# EAGLE design CDC_Amp_v31 (EAGLE 8.4.1)
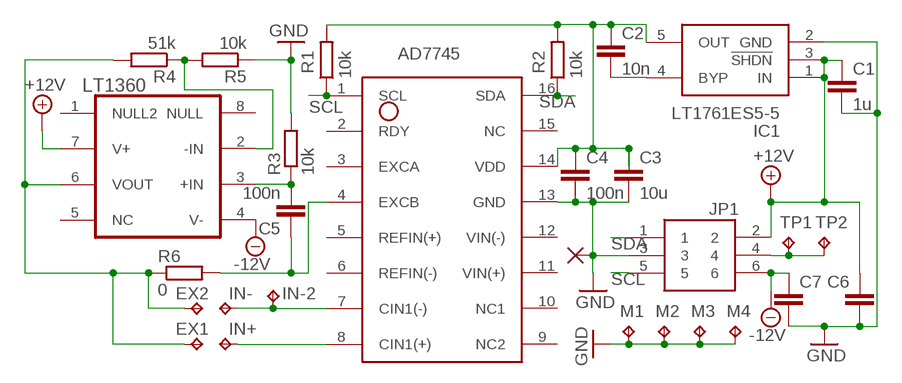
[diagram p0: schematic, sheet 1]

## Parts
AD7745  AD7745  AD7745_TSSOP_16  [AD7745_TSSOP_16]
C1  1u  RCL_C-EUC0805  [RCL_C0805]
C2  10n  RCL_C-EUC0805  [RCL_C0805]
C3  10u  RCL_C-EUC0805  [RCL_C0805]
C4  100n  RCL_C-EUC0805  [RCL_C0805]
C5  100n  RCL_C-EUC0805  [RCL_C0805]
C6  RCL_C-EUC1206  [RCL_C1206]
C7  RCL_C-EUC1206  [RCL_C1206]
EX1  TESTPAD_TPTP15R  [TESTPAD_TP15R]
EX2  TESTPAD_TPTP15R  [TESTPAD_TP15R]
GND  WIREPAD_1,6/0,8  [WIREPAD_1,6/0,8]
IC1  LT1761ES5-5  SAMACSYS_PARTS_LT1761ES5-5#TRMPBF  [SAMACSYS_PARTS_SOT95P280X100-5N]
IN+  TESTPAD_TPTP12R  [TESTPAD_TP12R]
IN-  TESTPAD_TPTP12R  [TESTPAD_TP12R]
IN-2  TESTPAD_TPTP12R  [TESTPAD_TP12R]
JP1  SAMACSYS_PARTS_FTSH-103-01-F-D  [SAMACSYS_PARTS_FTSH10301FD]
LT1360  LT1360CS8PBF  [SO8]
M1  TESTPAD_TPTP15R  [TESTPAD_TP15R]
M2  TESTPAD_TPTP15R  [TESTPAD_TP15R]
M3  TESTPAD_TPTP15R  [TESTPAD_TP15R]
M4  TESTPAD_TPTP15R  [TESTPAD_TP15R]
R1  10k  RCL_R-EU_R0805  [RCL_R0805]
R2  10k  RCL_R-EU_R0805  [RCL_R0805]
R3  10k  RCL_R-EU_R0805  [RCL_R0805]
R4  51k  RCL_R-EU_R0805  [RCL_R0805]
R5  10k  RCL_R-EU_R0805  [RCL_R0805]
R6  0  RCL_R-EU_R0603  [RCL_R0603]
TP1  TESTPAD_TPTP08SQ  [TESTPAD_TP08SQ]
TP2  TESTPAD_TPTP08SQ  [TESTPAD_TP08SQ]

## Nets
+12V: C1.1 C6.1 IC1.1(IN) IC1.3(!SHDN) JP1.2 LT1360.7(V+)
-12V: C7.1 JP1.6 LT1360.4(V-)
EX_IN: AD7745.4(EXCB) C5.1 R6.2
EX_OUT: EX1.TP EX2.TP LT1360.6(VOUT) R4.2 R6.1
GND: AD7745.13(GND) C1.2 C3.2 C4.2 C6.2 C7.2 GND.1(P) IC1.2(GND) JP1.3 M1.TP M2.TP M3.TP M4.TP R3.2 R5.1
N$1: C5.2 LT1360.3(+IN) R3.1
N$2: LT1360.2(-IN) R4.1 R5.2
N$6: JP1.4 TP1.TP TP2.TP
N$8: C2.2 IC1.4(BYP)
SCL: AD7745.1(SCL) JP1.5 R1.1
SDA: AD7745.16(SDA) JP1.1 R2.1
SIGIN: AD7745.8(CIN1(+)) IN+.TP
SIGIN-: AD7745.7(CIN1(-)) IN-2.TP IN-.TP
V_DD: AD7745.14(VDD) C2.1 C3.1 C4.1 IC1.5(OUT) R1.2 R2.2
Unconnected: AD7745.2(RDY) AD7745.3(EXCA) AD7745.5(REFIN(+)) AD7745.6(REFIN(-)) AD7745.9(NC2) AD7745.10(NC1) AD7745.11(VIN(+)) AD7745.12(VIN(-)) AD7745.15(NC) LT1360.1(NULL2) LT1360.5(NC) LT1360.8(NULL)

## Library data of the parts
AD7745 = CDC_Parts:AD7745_TSSOP_16: The AD7745/AD7746 are a high resolution, Σ-Δ capacitance-todigital converter (CDC). The capacitance to be measured is connected directly to the device inputs. The architecture features inherent high resolution (24-bit no missing codes, up to 21-bit effective resolution), high linearity (±0.01%), and high accuracy (±4 fF factory calibrated). The AD7745/AD7746 capacitance input range is ±4 pF (changing), while it can accept up to 17 pF common-mode capacitance (not changing), which can be balanced by a programmable on-chip, digital-tocapacitance converter (CAPDAC). The AD7745 has one capacitance input channel, while the AD7746 has two channels. Each channel can be configured as single-ended or differential. The AD7745/AD7746 are designed for floating capacitive sensors. For capacitive sensors with one plate connected to ground, the AD7747 is recommended. The parts have an on-chip temperature sensor with a resolution of 0.1°C and accuracy of ±2°C. The on-chip voltage reference and the on-chip clock generator eliminate the need for any external components in capacitive sensor applications. The parts have a standard voltage input, which together with the differential reference input allows easy interface to an external temperature sensor, such as an RTD, thermistor, or diode. The AD7745/AD7746 have a 2-wire, I2 C-compatible serial interface. Both parts can operate with a single power supply from 2.7 V to 5.25 V. They are specified over the automotive temperature range of –40°C to +125°C and are housed in a 16-lead TSSOP package.
C1-C7 = CDC_Parts:RCL_C-EU: CAPACITOR, European symbol; SPICEPREFIX: C
EX1 EX2 IN+ IN- IN-2 M1-M4 TP1 TP2 = CDC_Parts:TESTPAD_TP: Test pad
GND = CDC_Parts:WIREPAD_1,6/0,8: THROUGH-HOLE PAD
IC1 = CDC_Parts:SAMACSYS_PARTS_LT1761ES5-5#TRMPBF: Linear Technology LT1761ES5-3.3#TRMPBF, LDO Voltage Regulator, 100mA, 3.3 V, 1.8 20 Vin 5-Pin Source: Datasheet <https://componentsearchengine.com/Datasheets/1/LT1761ES5-3.3#TRMPBF.pdf>; DESCRIPTION: Linear Technology LT1761ES5-3.3#TRMPBF, LDO Voltage Regulator, 100mA, 3.3 V, 1.8 20 Vin 5-Pin; HEIGHT: 1mm; MANUFACTURER_NAME: Linear Technology; MANUFACTURER_PART_NUMBER: LT1761ES5-3.3#TRMPBF; MOUSER_PART_NUMBER: 584-1761ES5-3.3TMPF; MOUSER_PRICE-STOCK: https://www.mouser.com/Search/Refine.aspx?Keyword=584-1761ES5-3.3TMPF
JP1 = CDC_Parts:SAMACSYS_PARTS_FTSH-103-01-F-D: Conn Unshrouded Header HDR 6 POS 1.27mm Solder ST Thru-Hole Source: Datasheet <https://componentsearchengine.com/Datasheets/1/FTSH-103-01-F-D.pdf>; DESCRIPTION: Conn Unshrouded Header HDR 6 POS 1.27mm Solder ST Thru-Hole; HEIGHT: 5.56mm; MANUFACTURER_NAME: SAMTEC; MANUFACTURER_PART_NUMBER: FTSH-103-01-F-D; MOUSER_PART_NUMBER: 200-FTSH10301FD; MOUSER_PRICE-STOCK: https://www.mouser.com/Search/Refine.aspx?Keyword=200-FTSH10301FD
LT1360 = CDC_Parts:LT1360CS8PBF: 50MHz, 800V/us Op Amp; MPN: LT1360CS8#PBF; OC_FARNELL: 1330641; OC_NEWARK: 57M3487; PACKAGE: SOIC-8; SUPPLIER: Linear Technology
R1-R6 = CDC_Parts:RCL_R-EU_: RESISTOR, European symbol; SPICEPREFIX: R

## Board
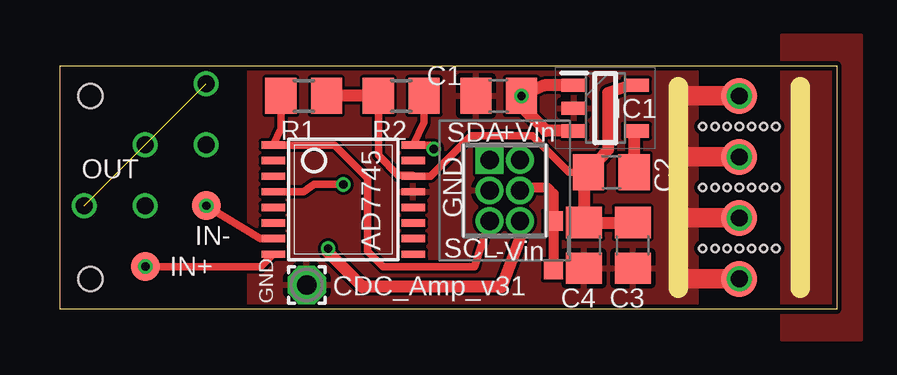
[diagram p1: board, top side]
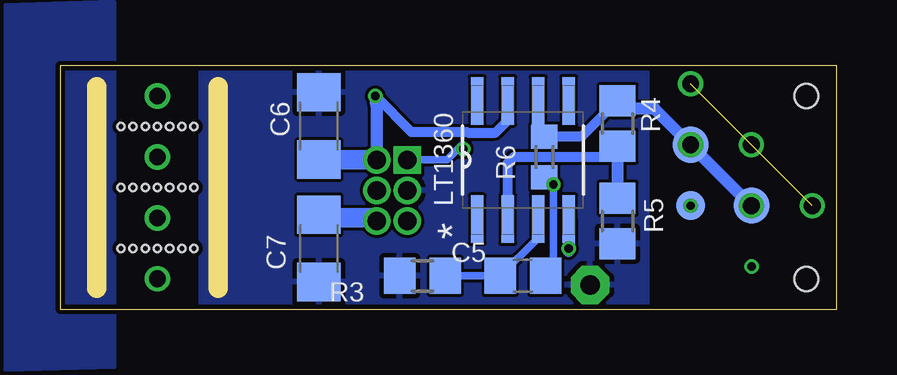
[diagram p2: board, bottom side, seen from below]

Size 32.38 x 10.16 mm. Coordinates in mm from the lower left corner, seen from the top.
Outline: 32.38,0 0,0 0,10.16 32.38,10.16 32.38,0
Copper layers (1*16): Top 0.018mm / dielectric 1.55mm / Bottom 0.018mm
Design rules "Multi-CB_2L_125um-Tracks_OL35um *": minimum track width 0.125mm, minimum drill 0.2mm, track to track 0.125mm, track to pad 0.125mm, pad to pad 0.1mm, via to via 0.125mm, smd to smd 0mil, copper to edge 0.2mm, drill to drill 0.2mm, minimum pad ring 0.125mm, minimum via ring 0.125mm, stop-mask expansion 2mil, vias tented up to drill 0.45mm, thermal gap 0.2mm
Holes 1 mm at 1.27,8.89 1.27,1.27
Holes 0.3 mm at 29.84,2.54 29.34,2.54 28.83,2.54 28.32,2.54 27.81,2.54 27.3,2.54 26.8,2.54 29.84,5.08 29.34,5.08 28.83,5.08 28.32,5.08 27.81,5.08 27.3,5.08 26.8,5.08 29.84,7.62 29.34,7.62 28.83,7.62 28.32,7.62 27.81,7.62 27.3,7.62 26.8,7.62
Milling: 2 lines

### Footprints (pad centres in the part's own frame; a part is rotated, then mirrored left to right if it is on the bottom)
AD7745_TSSOP_16 = smd 0.305 x 0.991: 1 -2.275,-2.918; 2 -1.625,-2.918; 3 -0.975,-2.918; 4 -0.325,-2.918; 5 0.325,-2.918; 6 0.975,-2.918; 7 1.625,-2.918; 8 2.275,-2.918; 9 2.275,2.918; 10 1.625,2.918; 11 0.975,2.918; 12 0.325,2.918; 13 -0.325,2.918; 14 -0.975,2.918; 15 -1.625,2.918; 16 -2.275,2.918
RCL_C0805 = smd 1.3 x 1.5: 1 -0.95,0; 2 0.95,0
RCL_C1206 = smd 1.6 x 1.8: 1 -1.4,0; 2 1.4,0
TESTPAD_TP15R = smd 1.5 x 1.5: TP 0,0
WIREPAD_1,6/0,8 = drill 0.813 pad 1.6 octagon: 1 0,0
SAMACSYS_PARTS_SOT95P280X100-5N = smd 1.05 x 0.55: 1 -1.3,0.95; 2 -1.3,0; 3 -1.3,-0.95; 4 1.3,-0.95; 5 1.3,0.95
TESTPAD_TP12R = smd 1.2 x 1.2: TP 0,0
SAMACSYS_PARTS_FTSH10301FD = drill 0.77 pad 1.1 square: 1 0,0 | drill 0.77 pad 1.1: 2 0,1.27; 3 1.27,0; 4 1.27,1.27; 5 2.54,0; 6 2.54,1.27
SO8 = smd 1.981 x 0.533: 1 -2.464,1.905; 2 -2.464,0.635; 3 -2.464,-0.635; 4 -2.464,-1.905; 5 2.464,-1.905; 6 2.464,-0.635; 7 2.464,0.635; 8 2.464,1.905
RCL_R0805 = smd 1.3 x 1.5: 1 -0.95,0; 2 0.95,0
RCL_R0603 = smd 1 x 1.1: 1 -0.85,0; 2 0.85,0
TESTPAD_TP08SQ = smd 0.8 x 0.8: TP 0,0

### Placement (x,y rotation side)
AD7745  11.81,4.57 270 top
C1  18.29,8.89 180 top
C2  22.99,5.71 0 top
C3  23.88,2.67 270 top
C4  21.84,2.67 270 top
C5  13.08,1.4 180 bottom
C6  21.59,7.64 90 bottom
C7  21.59,2.54 270 bottom
EX1  3.56,4.32 0 bottom
EX2  6.1,6.86 0 bottom
GND  10.29,1.02 0 top
IC1  22.73,8.38 0 top
IN+  3.56,1.78 0 top
IN-  6.1,4.32 0 top
IN-2  6.1,4.32 0 bottom
JP1  17.91,6.22 270 top
LT1360  13.08,6.22 90 bottom
M1  28.32,3.81 0 top
M2  28.32,1.27 0 top
M3  28.32,6.35 0 top
M4  28.32,8.89 0 top
R1  10.16,8.89 0 top
R2  14.22,8.89 180 top
R3  17.27,1.4 180 bottom
R4  9.14,7.75 90 bottom
R5  9.14,3.68 90 bottom
R6  12.19,6.35 270 bottom
TP1  20.57,1.65 0 top
TP2  20.57,3.68 0 top

### Tracks (layer width: path | path; a pad name or v marks a point on that pad's centre or on a via)
+12V  (via drill 0.35)
  Top 0.508: IC1.3 20.25,7.43 19.05,8.64 19.05,8.7 C1.1 20.19,9.33 IC1.1
  Bottom 0.406: C1.1 17.75,7.4 15.42,7.4 15.39,7.37 14.22,7.37 13.72,7.87 LT1360.7
  Bottom 0.508: JP1.2 19.18,8.45 C1.1
  Bottom 0.813: JP1.2 21.51,6.22 C6.1
  other vias: 19.24,8.89
-12V  (via drill 0.35)
  Top 0.508: v11.18,2.54 11.18,2.37 12.61,0.94 18.41,0.94 19.18,2.97 JP1.6
  Bottom 0.508: LT1360.4 v11.18,2.54 11.18,2.42
  Bottom 0.813: JP1.6 19.3,3.81 21.59,3.81 C7.1
EX_IN  (via drill 0.35)
  Top 0.305: AD7745.4 10.16,4.9 10.6,5.21 v11.81,5.21
  Bottom 0.305: v11.81,5.21 11.81,1.84 C5.1
  Bottom 0.406: v11.81,5.21 11.9,5.21 R6.2
EX_OUT  (via drill 0.7)
  Bottom 0.406: R4.2 10.64,7.2 R6.1 12.45,7.45 LT1360.6
  Bottom 0.508: R4.2 8.83,8.38 7.62,8.38 EX2.TP EX1.TP
  other vias: 3.56,4.32 6.1,6.86
GND  (via drill 0.7)
  Top 0.813: M2.TP 26.04,1.27 | M1.TP 26.04,3.81 | M3.TP 26.04,6.35 | M4.TP 26.04,8.89
  other vias: 28.32,8.89 28.32,6.35 28.32,3.81 28.32,1.27
  pour Top: 7.87,10.54 7.87,-0.51 26.54,-0.51 26.54,10.67
  pour Bottom: 7.87,11.3 7.87,-0.89 26.54,-0.89 26.54,11.43
GND2
  pour Bottom: 30.1,12.83 30.1,-2.41 34.67,-2.54 34.67,12.7
  pour Top: 30.1,11.43 30.1,-1.27 33.4,-1.27 33.4,11.43
N$1
  Bottom 0.305: LT1360.3 12.45,2.98 C5.2 R3.1
N$2
  Bottom 0.406: LT1360.2 13.72,6.1 13.46,6.35 9.14,6.35
  Bottom 0.508: R4.1 9.14,6.35 R5.2
N$3  (via drill 0.7)
  other vias: 3.56,6.86
N$4  (via drill 0.7)  (1 unrouted)
  other vias: 6.1,9.4 1.02,4.32
N$6
  Top 0.406: TP1.TP TP2.TP 20.57,4.83 20.32,5.08 19.3,5.08 JP1.4
N$8
  Top 0.508: 23.91,5.75 C2.2 23.94,7.34 IC1.4
SCL
  Top 0.305: R1.1 9.21,7.54 AD7745.1 11.44,6.85 12.83,5.46 12.83,2.41 13.46,1.78 17.27,1.78 JP1.5
SDA  (via drill 0.35)
  Top 0.305: R2.1 15.17,7.8 AD7745.16 15.42,6.85 v15.58,6.69
  Bottom 0.305: JP1.1 16.26,6.22 15.64,6.83 15.58,6.77 v15.58,6.69
SIGIN  (via drill 0.35)
  Top 0.305: AD7745.8 8.37,1.78 IN+.TP
  other vias: 3.56,1.78
SIGIN-  (via drill 0.35)
  Top 0.305: AD7745.7 8.36,2.95 IN-.TP
  other vias: 6.1,4.32
V_DD
  Top 0.305: R2.2 13.27,6.41 14.1,5.59 14.69,5.59 AD7745.14 15.45,5.55 17.14,7.24 19.7,7.24 21.22,5.71 C2.1
  Top 0.508: R2.2 R1.2 | C3.1 C4.1 21.84,5.39 22.1,5.65 C2.1 22.86,6.67 22.86,9.02 23.81,9.33 IC1.5

### Text on the board
tNames: SDA | +Vin | OUT | GND | SCL | -Vin | IN+ | CDC_Amp_v31